# Altium schematic sheet ETHERNET.SchDoc: DARKYDEN_ETHERNET
size Letter; ApprovedBy: APPROUVÉ PAR; Author: Harold Malbrouck; Organization: Cegep Limoilou; Address1: 1300, 8e Avenue; Address2: Québec, QC; Address3: Canada; Address4: G1J 5L5; Revision: Rev.C; SheetNumber: 11; SheetTotal: 23
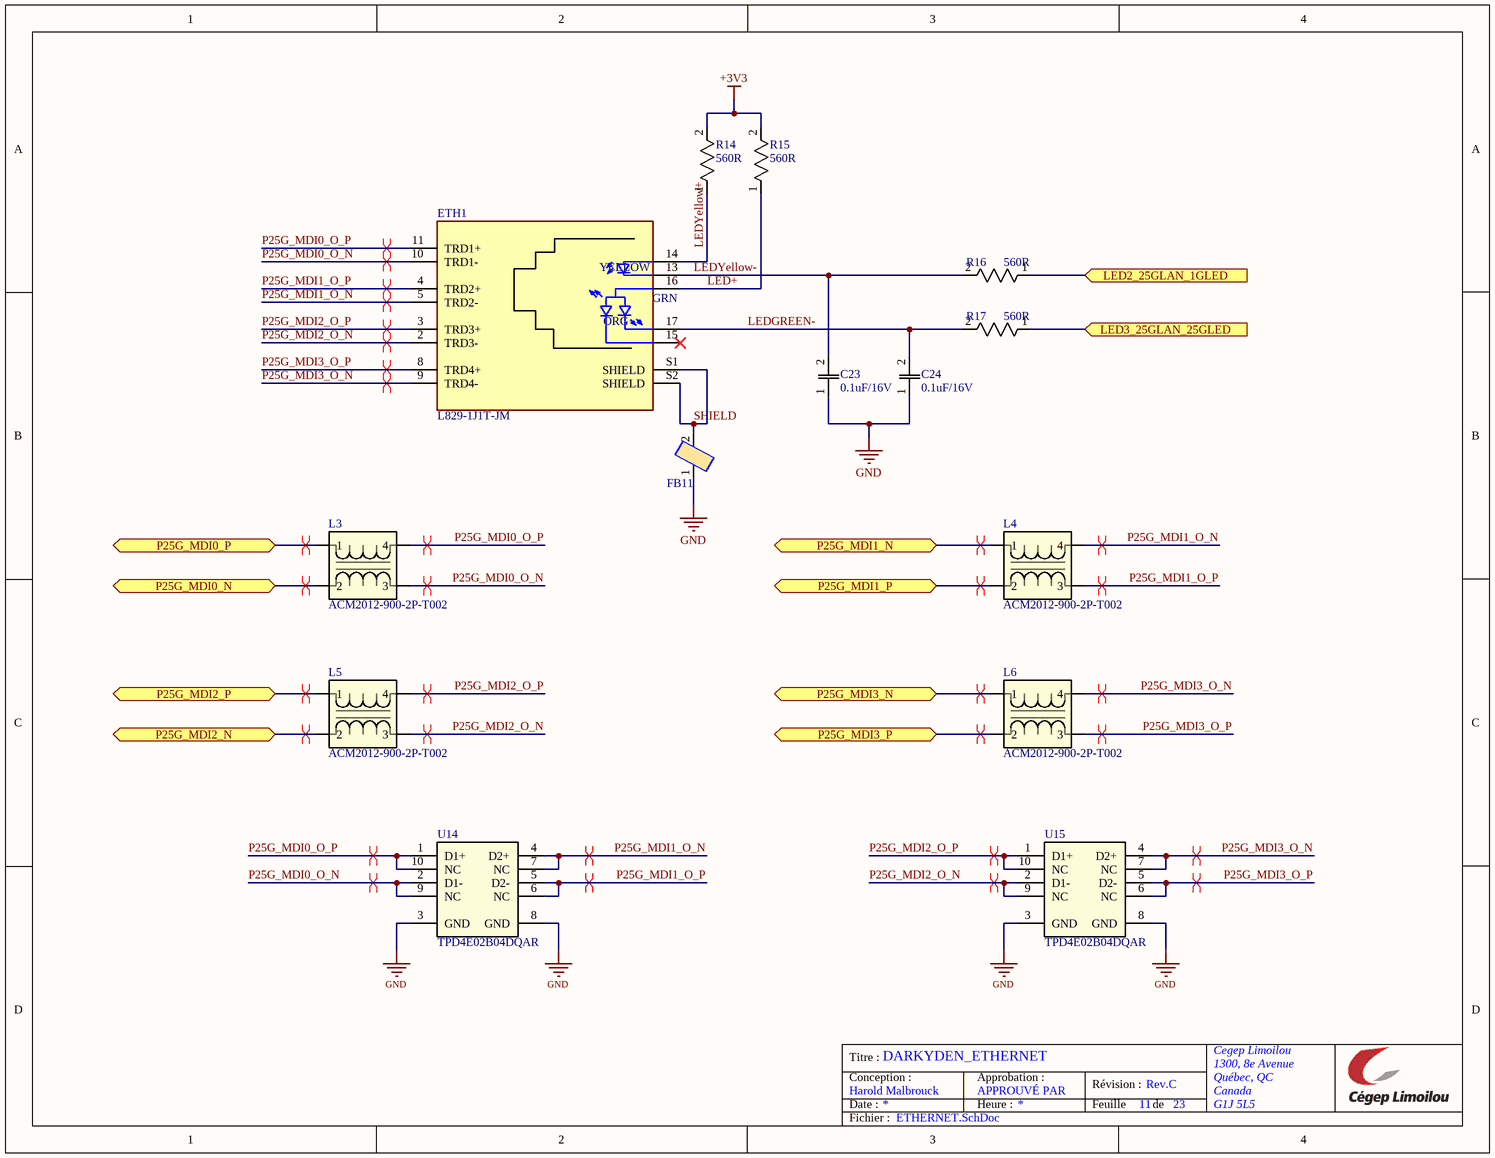
[diagram p0: ETHERNET.SchDoc]

## Parts
C23  0.1uF/16V  [C0805]
C24  0.1uF/16V  [C0805]
ETH1  L829-1J1T-JM  [RJ-45]
FB11  220R / 100MHz  [BLM18SP221SN1B]  (value not drawn)
L3  ACM2012-900-2P-T002  [ACM20129002PT002]
L4  ACM2012-900-2P-T002  [ACM20129002PT002]
L5  ACM2012-900-2P-T002  [ACM20129002PT002]
L6  ACM2012-900-2P-T002  [ACM20129002PT002]
R14  560R  [RESC1608X55N]
R15  560R  [RESC1608X55N]
R16  560R  [RESC1608X55N]
R17  560R  [RESC1608X55N]
U14  TPD4E02B04DQAR  [DQA0010A]
U15  TPD4E02B04DQAR  [DQA0010A]

## Ports
LED2_25GLAN_1GLED (in, see CONNECTEUR_1[3C]), LED3_25GLAN_25GLED (in, see CONNECTEUR_1[3C]), P25G_MDI0_N (bidir, see CONNECTEUR_1[3C]), P25G_MDI0_P (bidir, see CONNECTEUR_1[3C]), P25G_MDI1_N (bidir, see CONNECTEUR_1[3C]), P25G_MDI1_P (bidir, see CONNECTEUR_1[3C]), P25G_MDI2_N (bidir, see CONNECTEUR_1[3C]), P25G_MDI2_P (bidir, see CONNECTEUR_1[3C]), P25G_MDI3_N (bidir, see CONNECTEUR_1[3D]), P25G_MDI3_P (bidir, see CONNECTEUR_1[3D])

## Nets
+3V3: R14.2 R15.2
GND: C23.1 C24.1 FB11.1 U14.3(GND) U14.8(GND) U15.3(GND) U15.8(GND)
LED2_25GLAN_1GLED: R16.1 ; port LED2_25GLAN_1GLED
LED3_25GLAN_25GLED: R17.1 ; port LED3_25GLAN_25GLED
LED+: ETH1.16(CA) R15.1
LEDGREEN-: C24.2 ETH1.17(GK_1) R17.2
LEDYellow+: ETH1.14(YA_1) R14.1
LEDYellow-: C23.2 ETH1.13(YK_1) R16.2
P25G_MDI0_N: L3.2 ; port P25G_MDI0_N
P25G_MDI0_O_N: ETH1.10(TRD1-) L3.3 U14.2(D1-) U14.9(NC)
P25G_MDI0_O_P: ETH1.11(TRD1+) L3.4 U14.1(D1+) U14.10(NC)
P25G_MDI0_P: L3.1 ; port P25G_MDI0_P
P25G_MDI1_N: L4.1 ; port P25G_MDI1_N
P25G_MDI1_O_N: ETH1.5(TRD2-) L4.4 U14.4(D2+) U14.7(NC)
P25G_MDI1_O_P: ETH1.4(TRD2+) L4.3 U14.5(D2-) U14.6(NC)
P25G_MDI1_P: L4.2 ; port P25G_MDI1_P
P25G_MDI2_N: L5.2 ; port P25G_MDI2_N
P25G_MDI2_O_N: ETH1.2(TRD3-) L5.3 U15.2(D1-) U15.9(NC)
P25G_MDI2_O_P: ETH1.3(TRD3+) L5.4 U15.1(D1+) U15.10(NC)
P25G_MDI2_P: L5.1 ; port P25G_MDI2_P
P25G_MDI3_N: L6.1 ; port P25G_MDI3_N
P25G_MDI3_O_N: ETH1.9(TRD4-) L6.4 U15.4(D2+) U15.7(NC)
P25G_MDI3_O_P: ETH1.8(TRD4+) L6.3 U15.5(D2-) U15.6(NC)
P25G_MDI3_P: L6.2 ; port P25G_MDI3_P
SHIELD: ETH1.S1(SHIELD) ETH1.S2(SHIELD) FB11.2

Not connected (* = marked no-connect by the designer): ETH1 1(TRCT3) 6(TRCT2) 7(TRCT4) 12(TRCT1) 15(OK_1)*

## Layout directives
differential pair; differential pair class Ethernet; differential pair class Ethernet: P25G_MDI0_O_P, P25G_MDI3_O_N
differential pair; differential pair class Ethernet: P25G_MDI0_N, P25G_MDI0_O_N, P25G_MDI0_O_P, P25G_MDI0_P, P25G_MDI1_N, P25G_MDI1_O_N, P25G_MDI1_O_P, P25G_MDI1_P, P25G_MDI2_N, P25G_MDI2_O_N, P25G_MDI2_O_P, P25G_MDI2_P, P25G_MDI3_N, P25G_MDI3_O_N, P25G_MDI3_O_P, P25G_MDI3_P

## Notes on the sheet
- Titre :
- Conception :
- Date :
- Approbation :
- Heure :
- Révision :
- Feuille
- de
- Fichier :
- (in symbol L829-1J1T-JM) YELLOW; GRN; ORG

## Library data of the parts
C23 C24 = C0805C104K4RACAUTO: 0.1uF/16V ±10% X7R 0805 (2012METRIC) Ceramic Capacitor SMD Auto X7R; Mfr_Name: Kemet; Material: 4241ConductorMaterial; Value: 100nF; Temperature Coefficient: 30ppm/°C; Voltage Rating: 16V; Supplier: Digikey; Supplier Part Number: 399-C0805C104K4RACAUTOCT-ND; Manufacturer: KEMET; Manufacturer Part Number: C0805C104K4RACAUTO; RoHS: Yes; Category: Ceramic Capacitors; Stock: 27573; Pricing: 1=0.19, 10=0.108, 100=0.0672, 1000=0.04624 (USD); Case/Package: 0805; Dielectric Material: 4241ConductorMaterial; Min Operating Temperature: -55°C; Max Operating Temperature: 125°C; Tolerance: 10%; Packaging: Tape and Reel; Dielectric: X7R; Voltage Rating (DC): 16V; Length: 2mm; Depth: 1.25mm; RoHS Compliant: Yes
ETH1 = L829-1J1T-JM: Modular Connectors / Ethernet Connectors 1x1 2.5GBT MagJack; Manufacturer: Bel; MF: Bel Magnetic Solutions; Connector Type: RJ45; Direction: Up; Number of Ports: 1; Number of Cores per Jack: 4; Shielding: Shielded; MP: L829-1J1T-JM; DigiKey-Purchase-URL: https://snapeda.com/shop?store=DigiKey&id=2758678; SnapEDA_Link: https://www.snapeda.com/parts/L829-1J1T-JM/Bel%20Magnetic%20Solutions/view-part/2758678/?ref=snap; Digi-Key_Part_Number: 507-2068-ND; Package: None; Value: *; Supplier: Digikey; Supplier Part Number: 5923-L829-1J1T-JM-ND; Manufacturer Part Number: L829-1J1T-JM; RoHS: No; Category: Modular / Ethernet Connectors; Stock: 1135; Pricing: 1=6.03, 10=5.128, 25=4.8064, 50=4.5768, 100=4.3583, 250=4.08544, 660=3.81512, 1320=3.6332, 2640=3.46002 (USD); Mounting Technology: Through Hole,Edge,Board; Pins: 8NUMBER; Color: Green,Orange,Yellow; Contact Plating: Gold; Housing Material: Nylon; Min Operating Temperature: 0°C; Max Operating Temperature: 70°C; Packaging: Tray; Number of Rows: 1; Termination: Solder; Series: MagJack®; ComponentLink1URL: https://media.digikey.com/pdf/Data%20Sheets/Bel%20Fuse%20PDFs/L829-1J1T-JM_Prelim.pdf?src-supplier=Digikey; ComponentLink1Description: https://media.digikey.com/pdf/Data%20Sheets/Bel%20Fuse%20PDFs/L829-1J1T-JM_Prelim.pdf?src-supplier=Digikey; ComponentLink2URL: https://datasheet.octopart.com/L829-1J1T-JM-Bel-Fuse-datasheet-182766988.pdf?src-supplier=Sager+Electronics; ComponentLink2Description: https://datasheet.octopart.com/L829-1J1T-JM-Bel-Fuse-datasheet-182766988.pdf?src-supplier=Sager+Electronics
FB11 = BLM18EG221SN1D: Ferrite Beads Multi-Layer 220Ohm 25% 100MHz 2A 50mOhm DCR 0603 Paper T/R; Manufacturer_Name: Murata Electronics; Manufacturer: Murata; Material: Steel,Ferrite; Value: 50mR; Number of Lines: 1; Number of Circuits: 1NUMBER; Datasheet Link: http://www.murata.com/~/media/webrenewal/support/library/catalog/products/emc/emifil/c31e.ashx?la=en-gb; Height: 0.95mm; Manufacturer_Part_Number: BLM18EG221SN1D; Mouser Part Number: 81-BLM18EG221SN1D; Mouser Price/Stock: https://www.mouser.co.uk/ProductDetail/Murata-Electronics/BLM18EG221SN1D?qs=uSeJpk%2F8In2DDeSj2a4KGA%3D%3D; Arrow Part Number: BLM18EG221SN1D; Arrow Price/Stock: https://www.arrow.com/en/products/blm18eg221sn1d/murata-manufacturing?utm_currency=USD&region=nac; Supplier: Digikey; Supplier Part Number: 490-3992-1-ND; Manufacturer Part Number: BLM18EG221SN1D; RoHS: Yes; Category: Ferrite Beads and Chips; Stock: 133283; Pricing: 1=0.24, 10=0.167, 25=0.1444, 50=0.1292, 100=0.1154, 250=0.09864, 500=0.08708, 1000=0.07636 (USD); Case/Package: 0603; Pins: 2; Core Material: Ferrite; Case Code (Metric): 1608; Case Code (Imperial): 0603; Min Operating Temperature: -55°C; Max Operating Temperature: 125°C; Tolerance: 25%; Impedance: 220R; Package Quantity: 1; Packaging: Tape and Reel; Current Rating: 2A; Max Current Rating: 2A; DC Resistance (DCR): 50mR; Max DC Current: 2A; Termination: SMD/SMT; Test Frequency: 100MHz; DC Current: 2A; Series: BLM18E; DC Resistance-Max: 50mR; RMS Current (Irms): 2A; ESR: 50mR; Frequency: 100MHz; Length: 1.6mm; Width: 0.8mm; Depth: 0.8mm; Radiation Hardening: No; Reach SVHC Compliant: No; Military Standard: Not; Lead Free: Lead Free; RoHS Compliant: Yes; ComponentLink1URL: https://datasheet.ciiva.com/11799/0900766b811b5866-11799010.pdf?src-supplier=Rs; ComponentLink1Description: https://datasheet.ciiva.com/11799/0900766b811b5866-11799010.pdf?src-supplier=Rs; ComponentLink2URL: https://datasheet.ciiva.com/41449/001171699-da-01-en-chip-drossel0603-220r-2000ma-1-6x0-8mm-41449376.pdf?src-supplier=Conrad; ComponentLink2Description: https://datasheet.ciiva.com/41449/001171699-da-01-en-chip-drossel0603-220r-2000ma-1-6x0-8mm-41449376.pdf?src-supplier=Conrad; ComponentLink3URL: https://datasheet.ciiva.com/41449/001172265-da-01-en-drossel-0603-220r-1-6x0-8mm-4000st-41449579.pdf?src-supplier=Conrad; ComponentLink3Description: https://datasheet.ciiva.com/41449/001172265-da-01-en-drossel-0603-220r-1-6x0-8mm-4000st-41449579.pdf?src-supplier=Conrad; ComponentLink4URL: https://datasheet.ciiva.com/1012/l0110s0101blm18e-1012872.pdf?src-supplier=Digikey; ComponentLink4Description: https://datasheet.ciiva.com/1012/l0110s0101blm18e-1012872.pdf?src-supplier=Digikey; ComponentLink5URL: https://datasheet.ciiva.com/1012/l0110s0101blm18e-1012873.pdf?src-supplier=Digikey; ComponentLink5Description: https://datasheet.ciiva.com/1012/l0110s0101blm18e-1012873.pdf?src-supplier=Digikey; ComponentLink6URL: https://datasheet.ciiva.com/1012/l0110s0101blm18e-1012874.pdf?src-supplier=Digikey; ComponentLink6Description: https://datasheet.ciiva.com/1012/l0110s0101blm18e-1012874.pdf?src-supplier=Digikey; ComponentLink7URL: https://datasheet.ciiva.com/14122/blm-series-eng-tds-14122908.pdf?src-supplier=Distrelec; ComponentLink7Description: https://datasheet.ciiva.com/14122/blm-series-eng-tds-14122908.pdf?src-supplier=Distrelec; ComponentLink8URL: https://datasheet.ciiva.com/1467/5169-1467157.pdf?src-supplier=Element14; ComponentLink8Description: https://datasheet.ciiva.com/1467/5169-1467157.pdf?src-supplier=Element14; ComponentLink9URL: https://datasheet.ciiva.com/1467/5169-1467158.pdf?src-supplier=Element14; ComponentLink9Description: https://datasheet.ciiva.com/1467/5169-1467158.pdf?src-supplier=Element14; ComponentLink10URL: https://datasheet.ciiva.com/8510/l0110s0101blm18e-8510140.pdf?src-supplier=Avnet; ComponentLink10Description: https://datasheet.ciiva.com/8510/l0110s0101blm18e-8510140.pdf?src-supplier=Avnet; ComponentLink11URL: https://datasheet.ciiva.com/16419/l0110s0101blm18e-16419148.pdf?src-supplier=Future+Electronics; ComponentLink11Description: https://datasheet.ciiva.com/16419/l0110s0101blm18e-16419148.pdf?src-supplier=Future+Electronics
L3-L6 = ACM2012-900-2P-T002: Ferrite Beads Wirewound Common Mode Filter 90Ohm 100MHz 400mA 0805 T/R; Manufacturer_Name: TDK; Impedance: 90R; Voltage Rating: 50V; Number of Lines: 2; DC Resistance (DCR): 190mR; Shielding: Shielded; Datasheet Link: https://product.tdk.com/system/files/dam/doc/product/emc/emc/cmf_cmc/catalog/cmf_commercial_signal_acm2012_en.pdf; Height: 1.3mm; Manufacturer_Part_Number: ACM2012-900-2P-T002; Mouser Part Number: 810-ACM20129002PT002; Mouser Price/Stock: https://www.mouser.co.uk/ProductDetail/TDK/ACM2012-900-2P-T002?qs=vhEaPADELPHXWaCJFQVZjQ%3D%3D; Arrow Part Number: ACM2012-900-2P-T002; Arrow Price/Stock: https://www.arrow.com/en/products/acm2012-900-2p-t002/tdk?utm_currency=USD&region=europe; Supplier: Digikey; Supplier Part Number: 445-2207-1-ND; Manufacturer: TDK; Manufacturer Part Number: ACM2012-900-2P-T002; RoHS: Yes; Category: Common Mode Chokes; Stock: 26254; Pricing: 1=0.34, 10=0.277, 25=0.2564, 50=0.2416, 100=0.2278, 250=0.21076, 500=0.1987, 1000=0.18735 (USD); Mounting Technology: Surface Mount; Case/Package: 0805; Pins: 4; Case Code (Metric): 2012; Case Code (Imperial): 0805; Core Material: Ferrite; Min Operating Temperature: -40°C; Max Operating Temperature: 85°C; Packaging: Tape and Reel; Package Quantity: 1; Voltage Rating (DC): 50V; Current Rating: 400mA; Max DC Current: 400mA; Termination: SMD/SMT; Test Frequency: 100MHz; Current: 400mA; DC Current: 400mA; Series: ACM; DC Resistance-Max: 190mR; Max Current Rating: 400mA; RMS Current (Irms): 400mA; ESR: 190mR; Coil Resistance: 190mR; Length: 2.2mm; Width: 0.047inch; Depth: 1.4mm; Radiation Hardening: No; Reach SVHC Compliant: No; Military Standard: Not; RoHS Compliant: Yes; Lead Free: 5697LeadFree; ComponentLink1URL: https://datasheet.ciiva.com/26946/getdatasheetpartid-664745-26946491.pdf?src-supplier=Verical; ComponentLink1Description: https://datasheet.ciiva.com/26946/getdatasheetpartid-664745-26946491.pdf?src-supplier=Verical; ComponentLink2URL: https://datasheet.ciiva.com/1127/1750020-1127257.pdf?src-supplier=Element14; ComponentLink2Description: https://datasheet.ciiva.com/1127/1750020-1127257.pdf?src-supplier=Element14; ComponentLink3URL: https://datasheet.ciiva.com/22726/1750020-22726278.pdf?src-supplier=Element14; ComponentLink3Description: https://datasheet.ciiva.com/22726/1750020-22726278.pdf?src-supplier=Element14; ComponentLink4URL: https://datasheet.ciiva.com/28428/1750020-28428616.pdf?src-supplier=Element14; ComponentLink4Description: https://datasheet.ciiva.com/28428/1750020-28428616.pdf?src-supplier=Element14; ComponentLink5URL: https://datasheet.ciiva.com/46450/1750020-46450939.pdf?src-supplier=Element14; ComponentLink5Description: https://datasheet.ciiva.com/46450/1750020-46450939.pdf?src-supplier=Element14; ComponentLink6URL: https://datasheet.ciiva.com/1007/e9712-acm-1007624.pdf?src-supplier=Digikey; ComponentLink6Description: https://datasheet.ciiva.com/1007/e9712-acm-1007624.pdf?src-supplier=Digikey; ComponentLink7URL: https://datasheet.ciiva.com/1007/e9712-acm-1007623.pdf?src-supplier=Digikey; ComponentLink7Description: https://datasheet.ciiva.com/1007/e9712-acm-1007623.pdf?src-supplier=Digikey; ComponentLink8URL: https://datasheet.ciiva.com/1007/e9712-acm-1007625.pdf?src-supplier=Digikey; ComponentLink8Description: https://datasheet.ciiva.com/1007/e9712-acm-1007625.pdf?src-supplier=Digikey; ComponentLink9URL: https://datasheet.ciiva.com/4941/tdk-e9712-acm-332263-4941941.pdf?src-supplier=Mouser; ComponentLink9Description: https://datasheet.ciiva.com/4941/tdk-e9712-acm-332263-4941941.pdf?src-supplier=Mouser; ComponentLink10URL: https://datasheet.ciiva.com/16416/e9712-acm-16416522.pdf?src-supplier=Future+Electronics; ComponentLink10Description: https://datasheet.ciiva.com/16416/e9712-acm-16416522.pdf?src-supplier=Future+Electronics; ComponentLink11URL: https://datasheet.ciiva.com/8498/e9712-acm-8498823.pdf?src-supplier=Avnet; ComponentLink11Description: https://datasheet.ciiva.com/8498/e9712-acm-8498823.pdf?src-supplier=Avnet; ComponentLink12URL: https://datasheet.ciiva.com/16382/e9712-acm-16382582.pdf?src-supplier=Future+Electronics; ComponentLink12Description: https://datasheet.ciiva.com/16382/e9712-acm-16382582.pdf?src-supplier=Future+Electronics
R14-R17 = ERJ-3EKF5600V: 560 Ohm, ï¿½ 1%, 100 mW, 0603 [1608 Metric], Thick Film, Precision; Mfr_Name: Panasonic; Power Rating: 100mW; Voltage Rating: 75V; Temperature Coefficient: 100ppm/°C; Max Supply Voltage: 5V; Min Supply Voltage: 3V; Output Current: 2A; Output Voltage: 35V; Supplier: Digikey; Supplier Part Number: P560HCT-ND; Manufacturer: Panasonic; Manufacturer Part Number: ERJ-3EKF5600V; RoHS: Yes; Category: Chip SMD Resistors; Stock: 100259; Pricing: 1=0.1, 10=0.035, 100=0.0177, 1000=0.01014, 2500=0.00888 (USD); Mounting Technology: Surface Mount; Case/Package: 0603; Case Code (Imperial): 0603; Case Code (Metric): 1608; Weight: 7.1E-05oz; Contact Plating: Tin; Min Operating Temperature: -55°C; Max Operating Temperature: 155°C; Packaging: Tape and Reel; Value: 560R; Tolerance: 1%; Package Quantity: 1; Resistor Type: Thick Film; Termination: SMD/SMT; Number of Terminations: 2; Max Power Dissipation: 100mW; Voltage Rating (DC): 75V; Features: Automotive AEC-Q200; Series: ERJ; Construction: Rectangular; Resistance Tolerance: 1%; Length: 1.6mm; Width: 0.8mm; Height: 0.022inch; Depth: 0.8mm; Radiation Hardening: No; Reach SVHC Compliant: No; Military Standard: Not; Lead Free: Lead Free; RoHS Compliant: Yes; ComponentLink1URL: https://datasheet.ciiva.com/3883/3984280s8821682n1386-3883650.pdf?src-supplier=Arrow+Electronics; ComponentLink1Description: https://datasheet.ciiva.com/3883/3984280s8821682n1386-3883650.pdf?src-supplier=Arrow+Electronics; ComponentLink2URL: https://datasheet.ciiva.com/5860/aoa0000ce2-5860665.pdf?src-supplier=Farnell; ComponentLink2Description: https://datasheet.ciiva.com/5860/aoa0000ce2-5860665.pdf?src-supplier=Farnell; ComponentLink3URL: https://datasheet.ciiva.com/30250/aoa0000ce2-30250751.pdf?src-supplier=Onlinecomponents.com; ComponentLink3Description: https://datasheet.ciiva.com/30250/aoa0000ce2-30250751.pdf?src-supplier=Onlinecomponents.com; ComponentLink4URL: https://datasheet.ciiva.com/22674/1678782-22674427.pdf?src-supplier=Element14; ComponentLink4Description: https://datasheet.ciiva.com/22674/1678782-22674427.pdf?src-supplier=Element14; ComponentLink5URL: https://datasheet.ciiva.com/9117/aoa0000ce2-9117192.pdf?src-supplier=Avnet; ComponentLink5Description: https://datasheet.ciiva.com/9117/aoa0000ce2-9117192.pdf?src-supplier=Avnet; ComponentLink6URL: https://datasheet.ciiva.com/16763/70260748-16763150.pdf?src-supplier=Allied+Electronics; ComponentLink6Description: https://datasheet.ciiva.com/16763/70260748-16763150.pdf?src-supplier=Allied+Electronics; ComponentLink7URL: https://datasheet.ciiva.com/16781/70260748-16781128.pdf?src-supplier=Allied+Electronics; ComponentLink7Description: https://datasheet.ciiva.com/16781/70260748-16781128.pdf?src-supplier=Allied+Electronics; ComponentLink8URL: https://datasheet.ciiva.com/22737/426256-22737578.pdf?src-supplier=Element14; ComponentLink8Description: https://datasheet.ciiva.com/22737/426256-22737578.pdf?src-supplier=Element14; ComponentLink9URL: https://datasheet.ciiva.com/28590/1678782-28590766.pdf?src-supplier=Element14; ComponentLink9Description: https://datasheet.ciiva.com/28590/1678782-28590766.pdf?src-supplier=Element14
U14 U15 = TPD4E02B04DQAR: TVS DIODE 3.6V 8.8V 10USON / 4-Channel ESD Protection Diode for USB Type-C and HDMI 2.0; Mfr_Name: Texas Instruments; CompType: IC; Number of Bidirectional Channels: 4; Min Breakdown Voltage: 5.5V; Peak Pulse Power: 17W; Power Line Protection: No; Peak Pulse Current: 5A; Interface: USB,HDMI; Diode Type: ZENER; Direction: 211Direction; Breakdown Voltage: 6.4V; TYPE: TYPE; RefDes: RefDes; Application_BuildNumber: *; PartNumber: TPD4E02B04DQAR; PackageReference: DQA0010A; MountType: SMT; RoHS: Y; Manufacturer: Texas Instruments; Supplier: Digikey; Supplier Part Number: 296-43875-1-ND; Manufacturer Part Number: TPD4E02B04DQAR; Category: Integrated Circuits (ICs); Mounting Technology: Surface Mount; Pins: 10; Min Operating Temperature: -40°C; Max Operating Temperature: 125°C; Packaging: Cut Tape; Reverse Standoff Voltage: 3.6V; Operating Supply Voltage: 3.6V; Number of Channels: 4; Series: -; Length: 2.5mm; Width: 1mm; Height: 550um; Thickness: 500um; Reach SVHC Compliant: No; Lead Free: Lead Free; RoHS Compliant: Yes; ComponentLink1URL: http://www.ti.com/lit/ds/symlink/tpd4e02b04.pdf?src-supplier=Digikey; ComponentLink1Description: http://www.ti.com/lit/ds/symlink/tpd4e02b04.pdf?src-supplier=Digikey; ComponentLink2URL: http://www.ti.com/lit/ds/symlink/tpd4e02b04.pdf?src-supplier=Farnell; ComponentLink2Description: http://www.ti.com/lit/ds/symlink/tpd4e02b04.pdf?src-supplier=Farnell; ComponentLink3URL: http://www.ti.com/lit/ds/symlink/tpd4e02b04.pdf?src-supplier=Newark; ComponentLink3Description: http://www.ti.com/lit/ds/symlink/tpd4e02b04.pdf?src-supplier=Newark; ComponentLink4URL: http://www.ti.com/general/docs/lit/getliterature.tsp?genericPartNumber=TPD4E02B04&amp;&amp;fileType=pdf&src-supplier=Element14; ComponentLink4Description: http://www.ti.com/general/docs/lit/getliterature.tsp?genericPartNumber=TPD4E02B04&amp;&amp;fileType=pdf&src-supplier=Element14